# Altium schematic sheet spectrum_4kHz_125Hz.SchDoc
size A4; SheetNumber: 3; SheetTotal: 6
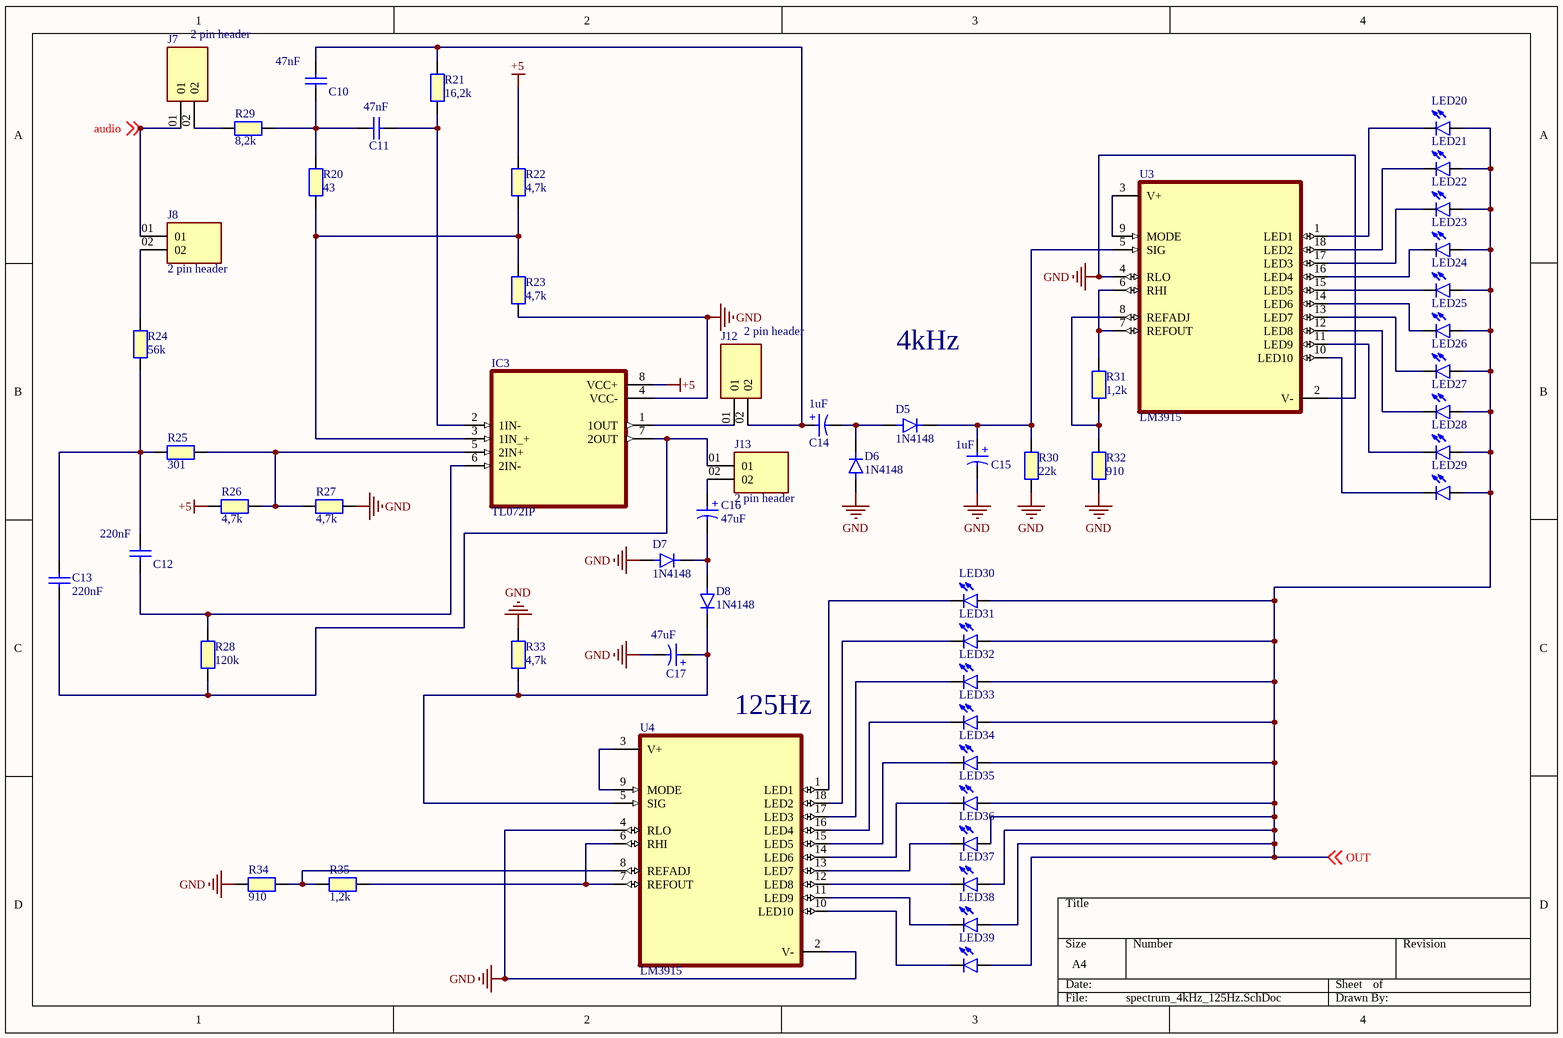
[diagram p0: spectrum_4kHz_125Hz.SchDoc]

## Parts
C10  47nF  [CAPC2012X65N]
C11  47nF  [CAPC2012X65N]
C12  220nF  [CAPC2012X65N]
C13  220nF  [CAPC2012X65N]
C14  1uF  [WCAP-ATG8_D5H11]
C15  1uF  [WCAP-ATG8_D5H11]
C16  47uF  [WCAP-ATG8_D5H11]
C17  47uF  [WCAP-ATG8_D5H11]
D5  1N4148  [DIOAD829W49L456D191]
D6  1N4148  [DIOAD829W49L456D191]
D7  1N4148  [DIOAD829W49L456D191]
D8  1N4148  [DIOAD829W49L456D191]
IC3  TL072IP  [DIP794W45P254L959H508Q8]
J7  2 pin header  [SAMTEC_HTSW-102-07-TM-S]
J8  2 pin header  [SAMTEC_HTSW-102-07-TM-S]
J12  2 pin header  [SAMTEC_HTSW-102-07-TM-S]
J13  2 pin header  [SAMTEC_HTSW-102-07-TM-S]
LED20  LED 2x3x4  [LED 2x3x4mm]  (value not drawn)
LED21  LED 2x3x4  [LED 2x3x4mm]  (value not drawn)
LED22  LED 2x3x4  [LED 2x3x4mm]  (value not drawn)
LED23  LED 2x3x4  [LED 2x3x4mm]  (value not drawn)
LED24  LED 2x3x4  [LED 2x3x4mm]  (value not drawn)
LED25  LED 2x3x4  [LED 2x3x4mm]  (value not drawn)
LED26  LED 2x3x4  [LED 2x3x4mm]  (value not drawn)
LED27  LED 2x3x4  [LED 2x3x4mm]  (value not drawn)
LED28  LED 2x3x4  [LED 2x3x4mm]  (value not drawn)
LED29  LED 2x3x4  [LED 2x3x4mm]  (value not drawn)
LED30  LED 2x3x4  [LED 2x3x4mm]  (value not drawn)
LED31  LED 2x3x4  [LED 2x3x4mm]  (value not drawn)
LED32  LED 2x3x4  [LED 2x3x4mm]  (value not drawn)
LED33  LED 2x3x4  [LED 2x3x4mm]  (value not drawn)
LED34  LED 2x3x4  [LED 2x3x4mm]  (value not drawn)
LED35  LED 2x3x4  [LED 2x3x4mm]  (value not drawn)
LED36  LED 2x3x4  [LED 2x3x4mm]  (value not drawn)
LED37  LED 2x3x4  [LED 2x3x4mm]  (value not drawn)
LED38  LED 2x3x4  [LED 2x3x4mm]  (value not drawn)
LED39  LED 2x3x4  [LED 2x3x4mm]  (value not drawn)
R20  43  [RESC2012X50N]
R21  16,2k  [RESC2012X50N]
R22  4,7k  [RESC2012X50N]
R23  4,7k  [RESC2012X50N]
R24  56k  [RESC2012X50N]
R25  301  [RESC2012X50N]
R26  4,7k  [RESC2012X50N]
R27  4,7k  [RESC2012X50N]
R28  120k  [RESC2012X50N]
R29  8,2k  [RESC2012X50N]
R30  22k  [RESC2012X50N]
R31  1,2k  [RESC2012X50N]
R32  910  [RESC2012X50N]
R33  4,7k  [RESC2012X50N]
R34  910  [RESC2012X50N]
R35  1,2k  [RESC2012X50N]
U3  LM3915  [DIP952W45P254L2336H533Q18]
U4  LM3915  [DIP952W45P254L2336H533Q18]

## Nets
+5: IC3.8(VCC+) R22.2 R26.2
GND: C15.2(N) C17.2(N) D6.A D7.A IC3.4(VCC-) R23.1 R27.2 R30.1 R32.2 R33.1 R34.2 U3.2(V-) U3.4(RLO) U4.2(V-) U4.4(RLO)
audio: J7.01 J8.01 ; off-sheet audio
OUT: LED20.A LED21.A LED22.A LED23.A LED24.A LED25.A LED26.A LED27.A LED28.A LED29.A LED30.A LED31.A LED32.A LED33.A LED34.A LED35.A LED36.A LED37.A LED38.A LED39.A ; off-sheet OUT
NetC10_1: C10.1 C11.1 R20.2 R29.2
NetC10_2: C10.2 C14.1(P) J12.02 R21.2
NetC11_2: C11.2 IC3.2(1IN-) R21.1
NetC12_1: C12.1 IC3.6(2IN-) R28.2
NetC12_2: C12.2 C13.2 R24.1 R25.2
NetC13_1: C13.1 IC3.7(2OUT) J13.01 R28.1
NetC14_2: C14.2(N) D5.A D6.C
NetC15_1: C15.1(P) D5.C R30.2 U3.5(SIG)
NetC16_1: C16.1(P) J13.02
NetC16_2: C16.2(N) D7.C D8.A
NetC17_1: C17.1(P) D8.C R33.2 U4.5(SIG)
NetIC3_1: IC3.1(1OUT) J12.01
NetIC3_3: IC3.3(1IN_+) R20.1 R22.1 R23.2
NetIC3_5: IC3.5(2IN+) R25.1 R26.1 R27.1
NetJ7_02: J7.02 R29.1
NetJ8_02: J8.02 R24.2
NetLED20_K: LED20.K(C) U3.1(LED1)
NetLED21_K: LED21.K(C) U3.18(LED2)
NetLED22_K: LED22.K(C) U3.17(LED3)
NetLED23_K: LED23.K(C) U3.16(LED4)
NetLED24_K: LED24.K(C) U3.15(LED5)
NetLED25_K: LED25.K(C) U3.14(LED6)
NetLED26_K: LED26.K(C) U3.13(LED7)
NetLED27_K: LED27.K(C) U3.12(LED8)
NetLED28_K: LED28.K(C) U3.11(LED9)
NetLED29_K: LED29.K(C) U3.10(LED10)
NetLED30_K: LED30.K(C) U4.1(LED1)
NetLED31_K: LED31.K(C) U4.18(LED2)
NetLED32_K: LED32.K(C) U4.17(LED3)
NetLED33_K: LED33.K(C) U4.16(LED4)
NetLED34_K: LED34.K(C) U4.15(LED5)
NetLED35_K: LED35.K(C) U4.14(LED6)
NetLED36_K: LED36.K(C) U4.13(LED7)
NetLED37_K: LED37.K(C) U4.12(LED8)
NetLED38_K: LED38.K(C) U4.11(LED9)
NetLED39_K: LED39.K(C) U4.10(LED10)
NetR31_1: R31.1 U3.6(RHI) U3.7(REFOUT)
NetR31_2: R31.2 R32.1 U3.8(REFADJ)
NetR34_1: R34.1 R35.2 U4.8(REFADJ)
NetR35_1: R35.1 U4.6(RHI) U4.7(REFOUT)
NetU3_3: U3.3(V+) U3.9(MODE)
NetU4_3: U4.3(V+) U4.9(MODE)

## Notes on the sheet
- 4kHz
- (near U4) 125Hz
- (in symbol 860010272005) +

## Library data of the parts
C10 C11 = 885012004008: 47nF ceramic; Manufacturer: Wurth Elektronik; Match Code: WCAP-CSGP; Case/Size Code: 0201; Capacitance: 22pF; Capacitance Tolerance: +/-5%; Ceramic Type: NP0 Class I; Insulation Resistance: 10GΩ; Q Factor: 840; Rated Voltage (DC): 25V; Technical Reference: NP00201220J025DFCT10000; Manufacturer Part Number: 885012004008; Category: Multilayer Ceramic Chip Capacitors; ComponentLink1Description: Website Link; ComponentLink1URL: https://www.we-online.com/redexpert/article/885012004008?ad; ComponentLink2Description: Datasheet Link; ComponentLink2URL: https://www.we-online.com/redexpert/spec/885012004008?ad; Mount: Surface Mount; Operating Temperature Max: 125°C; Operating Temperature Min: -55°C; Packaging: Tape and Reel; Length: 0.6mm; Width: 0.3mm; Height: 0.3mm
C12 C13 = 885012004008: 220nF ceramic; Manufacturer: Wurth Elektronik; Match Code: WCAP-CSGP; Case/Size Code: 0201; Capacitance: 22pF; Capacitance Tolerance: +/-5%; Ceramic Type: NP0 Class I; Insulation Resistance: 10GΩ; Q Factor: 840; Rated Voltage (DC): 25V; Technical Reference: NP00201220J025DFCT10000; Manufacturer Part Number: 885012004008; Category: Multilayer Ceramic Chip Capacitors; ComponentLink1Description: Website Link; ComponentLink1URL: https://www.we-online.com/redexpert/article/885012004008?ad; ComponentLink2Description: Datasheet Link; ComponentLink2URL: https://www.we-online.com/redexpert/spec/885012004008?ad; Mount: Surface Mount; Operating Temperature Max: 125°C; Operating Temperature Min: -55°C; Packaging: Tape and Reel; Length: 0.6mm; Width: 0.3mm; Height: 0.3mm
C14 = 860010272005: Elco 1uF; Manufacturer: Wurth Elektronik; Match Code: WCAP-ATG8; Capacitance: 100µF; Capacitance Tolerance: +/-20%; Dissipation Factor: 19%; Endurance: 2000h; Leakage Current: 10µA; Rated Voltage (DC): 10V; Ripple Current: 198mA; Technical Reference: ATBC110101M010DSPA3B000; Manufacturer Part Number: 860010272005; Category: Aluminum Electrolytic Capacitors; ComponentLink1Description: Website Link; ComponentLink1URL: https://www.we-online.com/redexpert/article/860010272005?ad; ComponentLink2Description: Datasheet Link; ComponentLink2URL: https://www.we-online.com/redexpert/spec/860010272005?ad; Mount: Through Hole; Operating Temperature Max: 85°C; Operating Temperature Min: -40°C; Packaging: Ammo Pack; Height: 11mm; Diameter: 5mm
C15 = 860010272005: WCAP-ATG8 Aluminum Electrolytic Capacitor, Radial, THT, D5 x H11mm, 1uF, 10V; Manufacturer: Wurth Elektronik; Capacitance: 100µF; Capacitance Tolerance: +/-20%; Dissipation Factor: 19%; Endurance: 2000h; Leakage Current: 10µA; Ripple Current: 198mA; Technical Reference: ATBC110101M010DSPA3B000; Manufacturer Part Number: 860010272005; Category: Aluminum Electrolytic Capacitors; Match Code: WCAP-ATG8; ComponentLink1Description: Website Link; ComponentLink1URL: https://www.we-online.com/redexpert/article/860010272005?ad; ComponentLink2Description: Datasheet Link; ComponentLink2URL: https://www.we-online.com/redexpert/spec/860010272005?ad; Mount: Through Hole; Operating Temperature Max: 85°C; Operating Temperature Min: -40°C; Packaging: Ammo Pack; Height: 11mm; Diameter: 5mm; Rated Voltage (DC): 10V
C16 = 860010272005: Elco 47uF; Manufacturer: Wurth Elektronik; Match Code: WCAP-ATG8; Capacitance: 100µF; Capacitance Tolerance: +/-20%; Dissipation Factor: 19%; Endurance: 2000h; Leakage Current: 10µA; Rated Voltage (DC): 10V; Ripple Current: 198mA; Technical Reference: ATBC110101M010DSPA3B000; Manufacturer Part Number: 860010272005; Category: Aluminum Electrolytic Capacitors; ComponentLink1Description: Website Link; ComponentLink1URL: https://www.we-online.com/redexpert/article/860010272005?ad; ComponentLink2Description: Datasheet Link; ComponentLink2URL: https://www.we-online.com/redexpert/spec/860010272005?ad; Mount: Through Hole; Operating Temperature Max: 85°C; Operating Temperature Min: -40°C; Packaging: Ammo Pack; Height: 11mm; Diameter: 5mm
C17 = 860010272005: WCAP-ATG8 Aluminum Electrolytic Capacitor, Radial, THT, D5 x H11mm, 47µF, 10V; Manufacturer: Wurth Elektronik; Capacitance: 100µF; Capacitance Tolerance: +/-20%; Dissipation Factor: 19%; Endurance: 2000h; Leakage Current: 10µA; Ripple Current: 198mA; Technical Reference: ATBC110101M010DSPA3B000; Manufacturer Part Number: 860010272005; Category: Aluminum Electrolytic Capacitors; Match Code: WCAP-ATG8; ComponentLink1Description: Website Link; ComponentLink1URL: https://www.we-online.com/redexpert/article/860010272005?ad; ComponentLink2Description: Datasheet Link; ComponentLink2URL: https://www.we-online.com/redexpert/spec/860010272005?ad; Mount: Through Hole; Operating Temperature Max: 85°C; Operating Temperature Min: -40°C; Packaging: Ammo Pack; Height: 11mm; Diameter: 5mm; Rated Voltage (DC): 10V
D5-D8 = 1N4148: Diode Standard 75V 200mA Surface Mount SOD-523F; MF: ON Semiconductor; Price: None; Availability: In Stock; Package: AXIAL LEAD-2 ON Semiconductor; MP: 1N4148; Value: *; SnapEDA_Link: https://www.snapeda.com/parts/1N4148/Onsemi/view-part/?ref=snap; Purchase-URL: https://pricing.snapeda.com/search/part/1N4148/?ref=eda; Check_prices: https://www.snapeda.com/parts/1N4148/Onsemi/view-part/?ref=eda
IC3 = TL072IP: Dual, 30-V, 3-MHz, high slew rate (13-V/Âµs), In to V+, JFET-input op amp; MF: Texas Instruments; Price: None; Package: PDIP-8 Texas; Purchase-URL: https://pricing.snapeda.com/search/part/TL072IP/?ref=eda; Availability: In Stock; SnapEDA_Link: https://www.snapeda.com/parts/TL072IP/Texas+Instruments/view-part/?ref=snap; Value: *; MP: TL072IP; Check_prices: https://www.snapeda.com/parts/TL072IP/Texas+Instruments/view-part/?ref=eda
J7 J8 J12 J13 = 2 pin header: 2 pin header Jumper; MP: HTSW10207TMS; MF: Samtec; SnapEDA_Link: https://www.snapeda.com/parts/HTSW10207TMS/Samtec/view-part/?ref=snap; Value: *; Purchase-URL: https://pricing.snapeda.com/search/part/HTSW10207TMS/?ref=eda; Availability: In Stock; Check_prices: https://www.snapeda.com/parts/HTSW10207TMS/Samtec/view-part/?ref=eda; Package: None; Price: None
LED20-LED39 = LED 2x3x4: Green 569nm LED Indication - Discrete 1.9V Radial; MP: TLLG4400; MF: Vishay Semiconductors; SnapEDA_Link: https://www.snapeda.com/parts/TLLG4400/Vishay/view-part/?ref=snap; Availability: In Stock; Package: None; Check_prices: https://www.snapeda.com/parts/TLLG4400/Vishay/view-part/?ref=eda; Value: *; Purchase-URL: https://pricing.snapeda.com/search/part/TLLG4400/?ref=eda; Price: None
R20 = RESISTOR 0805: 43Ohm Resistor 0805; Part Number: TNPW080510K0BETA; Manufacturer: Vishay Dale
R21 = RESISTOR 0805: 16,2k Resistor 0805; Part Number: TNPW080510K0BETA; Manufacturer: Vishay Dale
R22 R23 R26 R27 R33 = RESISTOR 0805: 4,7k Resistor 0805; Part Number: TNPW080510K0BETA; Manufacturer: Vishay Dale
R24 = RESISTOR 0805: 75k Resistor 0805; Part Number: TNPW080510K0BETA; Manufacturer: Vishay Dale
R25 = RESISTOR 0805: 301 Resistor 0805; Part Number: TNPW080510K0BETA; Manufacturer: Vishay Dale
R28 = RESISTOR 0805: 120k Resistor 0805; Part Number: TNPW080510K0BETA; Manufacturer: Vishay Dale
R29 = RESISTOR 0805: 8,2k Resistor 0805; Part Number: TNPW080510K0BETA; Manufacturer: Vishay Dale
R30 = RESISTOR 0805: 22k Resistor 0805; Part Number: TNPW080510K0BETA; Manufacturer: Vishay Dale
R31 R35 = RESISTOR 0805: 1,2k Resistor 0805; Part Number: TNPW080510K0BETA; Manufacturer: Vishay Dale
R32 R34 = RESISTOR 0805: 910 Resistor 0805; Part Number: TNPW080510K0BETA; Manufacturer: Vishay Dale
U3 U4 = LM3915: MP: LM3914N-1; Package: None; Availability: Unavailable; Price: None; Value: *